# EasyEDA Pro project PCB-1.2-ES.epro, board PCB1
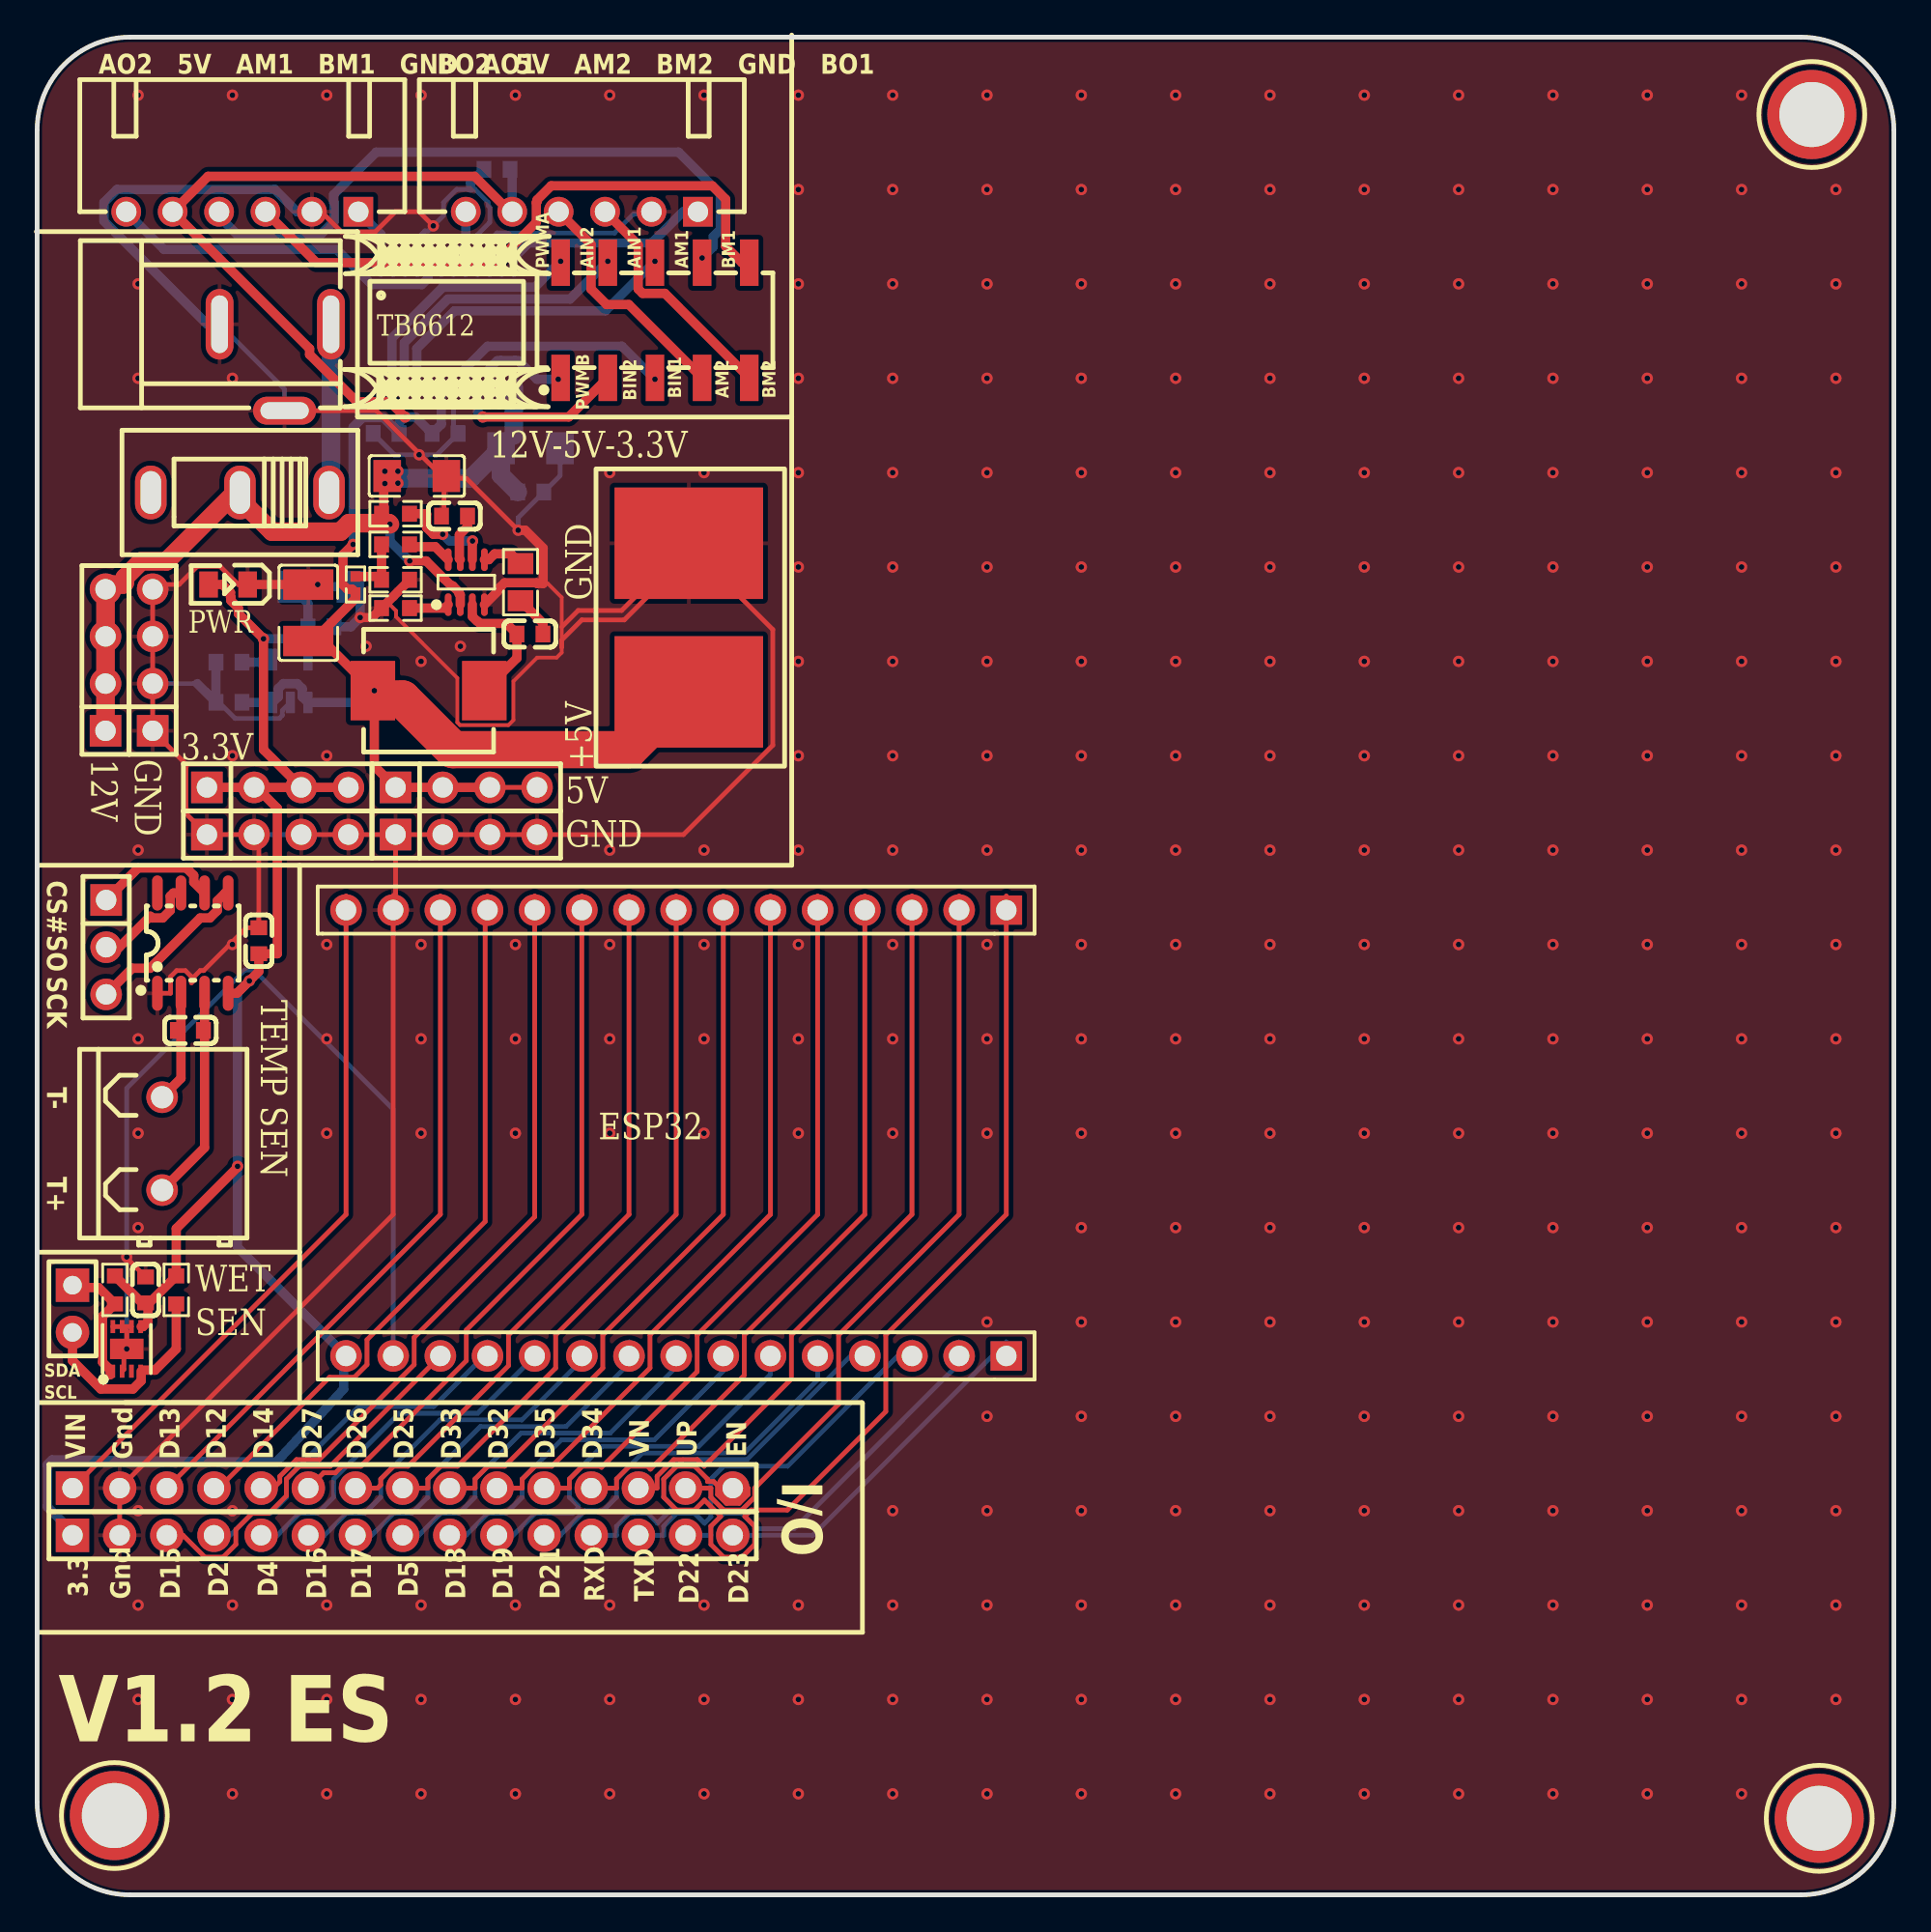
[diagram p1: board, top side]
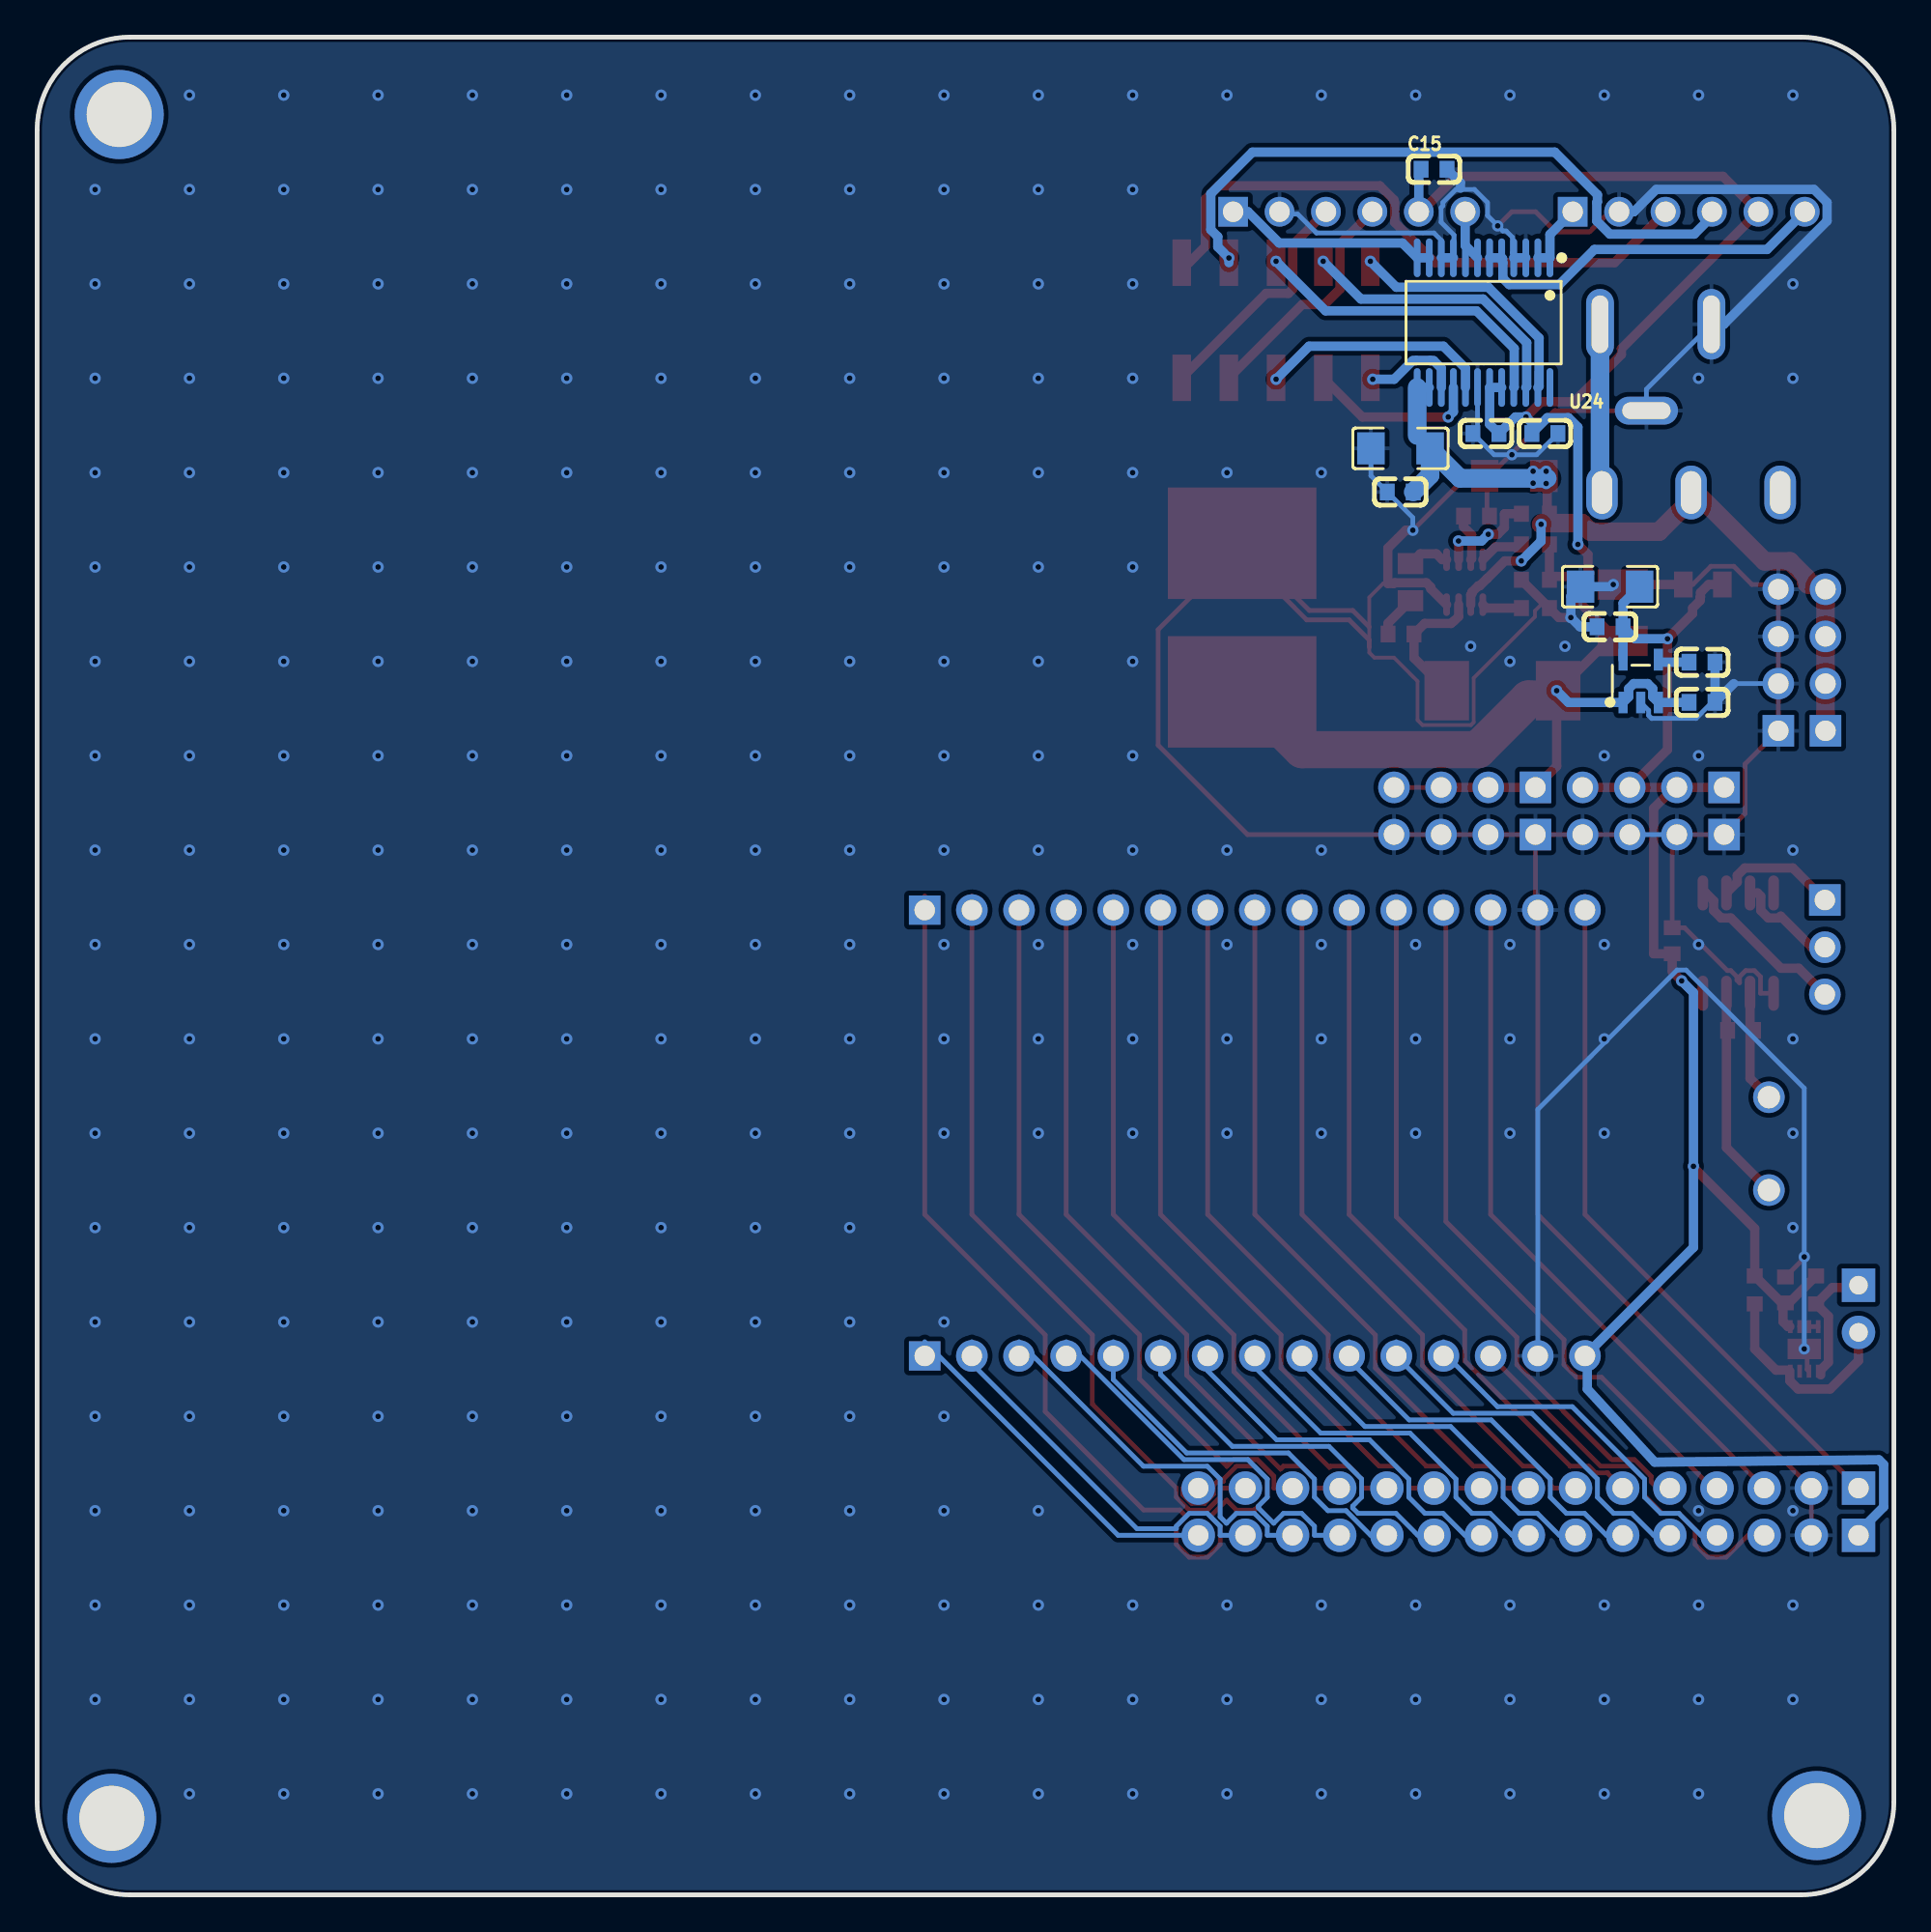
[diagram p2: board, bottom side, seen from below]

Outline 100 x 100 mm; copper layers: Top Layer, Bottom Layer. Coordinates in mm from the lower left corner of the outline.
Outline path: 0,95 0,5 arc(1.46,1.46) 5,0 95,0 arc(98.54,1.46) 100,5 100,95 arc(98.54,98.54) 95,100 5,100 arc(1.46,98.54) 0,95
Stack: Top Layer 0.035mm / Dielectric1 1.51mm FR4 er 4.5 / Bottom Layer 0.035mm

## Design rules (mm)
template: JLCPCB Capability(Two Layers Board)
spacing copperThickness1oz (default): track to track 0.102, other pairs 0.152 to 0.3
spacing copperThickness2oz: track to track 0.203, other pairs 0.152 to 0.3
track width copperThickness1oz (default): min 0.127, default 0.254, max 2.54
track width copperThickness2oz: min 0.203, default 0.254, max 2.54
differential pair differentialPair (default): width min 0.127, default 0.254, max 2.54; gap min 0.152, default 0.152
via viaSize (default): diameter min 0.5, default 0.61, max 10; hole min 0.3, default 0.305, max 6.3

## Placement (name value [footprint] x y rotation side)
C5  22uF  [C1206]  20.45 76.38 180 top
C6  100nF  [C0603]  22.48 74.22 0 top
C7  47uF  [C1210]  14.6 69.01 270 top
C8  100nF  [C0603]  26.54 67.87 0 top
C9  1uF  [C0603]  10.33 64.2 0 bottom
C10  22nF  [C0603]  10.33 66.35 0 bottom
C11  10uF  [C1206]  15.28 70.42 180 bottom
C12  100nF  [C0603]  15.28 68.26 180 bottom
C15  100nF  [C0603]  24.77 92.89 180 bottom
C16  100nF  [C0603]  26.59 75.52 0 bottom
C17  10uF  [C1206]  26.57 77.86 0 bottom
C18  100nF  [C0603]  18.8 78.66 0 bottom
C19  100nF  [C0603]  21.97 78.66 180 bottom
C20  100nF  [C0603]  11.94 51.36 90 top
C21  10nF  [C0603]  8.25 46.53 0 top
C22  100nF  [C0603]  5.84 32.56 270 top
CN1  X8821WR-06S-N0SN  [CONN-TH_6P-P2.50_X8821WR-06S-N2SN]  29.34 90.6 180 top
CN2  X8821WR-06S-N0SN  [CONN-TH_6P-P2.50_X8821WR-06S-N2SN]  11.05 90.6 180 top
DC1  DC-005-A200  [DC-IN-TH_DC-005-A200]  12.83 82.22 0 top
H1-12  PZ254V-11-04P  [HDR-TH_4P-P2.54-V-M]  3.68 66.47 90 top
H2  PZ254V-11-04P  [HDR-TH_4P-P2.54-V-M]  6.22 66.47 90 top
H3-5  PZ254V-11-04P  [HDR-TH_4P-P2.54-V-M]  23.11 59.61 0 top
H4  PZ254V-11-04P  [HDR-TH_4P-P2.54-V-M]  23.11 57.07 0 top
H5-3.3  PZ254V-11-04P  [HDR-TH_4P-P2.54-V-M]  12.95 59.61 0 top
H6  PZ254V-11-04P  [HDR-TH_4P-P2.54-V-M]  12.95 57.07 0 top
H7  HC-PZ254-11.5L-1x15PZ  [HDR-TH_15P-P2.54-V-M-1]  19.69 21.9 0 top
H8  HC-PZ254-11.5L-1x15PZ  [HDR-TH_15P-P2.54-V-M-1]  19.69 19.36 0 top
H11  IPCP254M10PB28S  [HDR-SMD_10P-P2.54-V-M-R2-C5-S2.54-LS7.3]  33.27 84.76 0 top
H12  PZ254V-11-03P  [HDR-TH_3P-P2.54-V-M]  3.72 51.01 270 top
H13  -  [HDR-TH_2P-P2.54-V-M-1]  1.91 31.55 270 top
L2  6.8uH  [IND-SMD_L7.0-W6.6]  21.08 64.82 180 top
LED1  NCD0805R1  [LED0805-R-RD]  10.29 70.54 180 top
R5  100kΩ  [R0603]  19.3 74.35 180 top
R6  75kΩ  [R0603]  19.3 69.27 180 top
R7  20kΩ  [R0603]  19.3 72.7 180 top
R8  40.2kΩ  [R0402]  17.14 70.54 270 top
R9  7.5kΩ  [R0603]  19.3 70.79 180 top
R10  20Ω  [R0805]  26.03 70.66 90 top
R16  10kΩ  [R0603]  7.49 32.56 90 top
R17  10kΩ  [R0603]  4.19 32.56 90 top
U2  MP2315GJ-Z  [TSOT-23-8_L2.9-W1.6-P0.65-LS2.8-BR]  23.11 70.66 270 top
U3  RT9193-33GB  [SOT-23-5_L3.0-W1.7-P0.95-LS2.8-BL]  13.63 65.34 180 bottom
U4  SS12D10G5  [SW-TH_SHOU-HAN_SS12D10G4]  10.92 75.49 180 top
U5  -  [SMD_BD4.2-L4.7-W4.7-D3.0]  95.98 4.12 0 top
U5-M1  KH-2.54FH-1X15P-H8.5  [HDR-TH_15P-P2.54-V-F]  34.42 53.01 180 top
U6-M1  KH-2.54FH-1X15P-H8.5  [HDR-TH_15P-P2.54-V-F]  34.42 29.01 180 top
U7  -  [SMD_BD4.2-L4.7-W4.7-D3.0]  4.16 4.27 0 top
U12  -  [SMD_BD4.2-L4.7-W4.7-D3.0]  95.58 95.84 0 top
U24  TB6612FNG(O,C,8,EL  [SSOP-24_L8.4-W5.8-P0.65-LS7.8-BL]  22.1 84.63 0 bottom
U25  MAX31855KASA+T  [SO-8_L4.9-W3.9-P1.27-LS5.9-BL]  8.38 51.23 0 top
U26  -  [CONN-TH_DB302-5.0-2P]  6.73 40.44 270 top
U27  SHT30-DIS-B10KS  [DFN-8_L2.5-W2.5-P0.50-BL-EP]  4.83 29.39 0 top
U28  -  [PWR]  30.1 60.76 90 top

## Footprints (pads in the part's own frame, mm; a bottom-side part is the same pattern mirrored in y, then rotated)
C0603
  rect 0.8x0.9 smd: 1(-0.7,0) 2(0.7,0)
C1206
  rect 1.485x1.728 smd: 1(-1.593,0) 2(1.593,0)
C1210
  rect 1.635x2.7 smd: 1(-1.518,0) 2(1.518,0)
CONN-TH_6P-P2.50_X8821WR-06S-N2SN
  rect 1.6x1.6 hole 1.1: 1(-6.25,0)
  round 1.6 hole 1.1: 2(-3.75,0) 3(-1.25,0) 4(1.25,0) 5(3.75,0) 6(6.25,0)
CONN-TH_DB302-5.0-2P
  round 1.7 hole 1.2: 1(-2.5,0) 2(2.5,0)
DC-IN-TH_DC-005-A200
  oval 1.5x3.8 hole 0.9x3.1: 1(2.999,2.325) 2(-3,2.325)
  oval 3.4x1.5 hole 2.6x0.9: 3(0.5,-2.325)
DFN-8_L2.5-W2.5-P0.50-BL-EP
  rect 0.25x0.7 smd: 1(-0.75,-1.2) 2(-0.25,-1.2) 3(0.25,-1.2) 4(0.75,-1.2) 5(0.75,1.2) 6(0.25,1.2) 7(-0.25,1.2) 8(-0.75,1.2)
  rect 1.8x1.1 smd: 9(0,0)
HDR-SMD_10P-P2.54-V-M-R2-C5-S2.54-LS7.3
  rect 1x2.5 smd: 1(-5.08,-3.1) 2(-5.08,3.1) 3(-2.54,-3.1) 4(-2.54,3.1) 5(0,-3.1) 6(0,3.1) 7(2.54,-3.1) 8(2.54,3.1) 9(5.08,-3.1) 10(5.08,3.1)
HDR-TH_2P-P2.54-V-M-1
  rect 1.8x1.8 hole 1: 1(-1.27,0)
  round 1.8 hole 1: 2(1.27,0)
HDR-TH_3P-P2.54-V-M
  rect 1.7x1.7 hole 1.1: 1(-2.54,0)
  round 1.7 hole 1.1: 2(0,0) 3(2.54,0)
HDR-TH_4P-P2.54-V-M
  rect 1.7x1.7 hole 1.1: 1(-3.81,0)
  round 1.7 hole 1.1: 2(-1.27,0) 3(1.27,0) 4(3.81,0)
HDR-TH_15P-P2.54-V-F
  rect 1.7x1.575 hole 1.1: 1(-17.78,0)
  round 1.7 hole 1.1: 2(-15.24,0) 3(-12.7,0) 4(-10.16,0) 5(-7.62,0) 6(-5.08,0) 7(-2.54,0) 8(0,0) 9(2.54,0) 10(5.08,0) 11(7.62,0) 12(10.16,0) 13(12.7,0) 14(15.24,0) 15(17.78,0)
HDR-TH_15P-P2.54-V-M-1
  rect 1.8x1.8 hole 1.1: 1(-17.78,0)
  round 1.8 hole 1.1: 2(-15.24,0) 3(-12.7,0) 4(-10.16,0) 5(-7.62,0) 6(-5.08,0) 7(-2.54,0) 8(0,0) 9(2.54,0) 10(5.08,0) 11(7.62,0) 12(10.16,0) 13(12.7,0) 14(15.24,0) 15(17.78,0)
IND-SMD_L7.0-W6.6
  rect 2.4x3.2 smd: 1(-3,0) 2(3,0)
LED0805-R-RD
  rect 1x1.399 smd: 1(1.05,0) 2(-1.05,0)
PWR
  custom 6x8 smd: 1(4,-5) 2(12,-5)
R0402
  rect 0.566x0.54 smd: 1(-0.433,0) 2(0.433,0)
R0603
  rect 0.806x0.864 smd: 1(-0.753,0) 2(0.753,0)
R0805
  rect 1.133x1.377 smd: 1(-1,0) 2(1,0)
SMD_BD4.2-L4.7-W4.7-D3.0
  round 4.8 hole 3.5: 1(0,0)
SO-8_L4.9-W3.9-P1.27-LS5.9-BL
  oval 0.574x1.888 smd: 1(-1.905,-2.699) 2(-0.635,-2.699) 3(0.635,-2.699) 4(1.905,-2.699) 5(1.905,2.699) 6(0.635,2.699) 7(-0.635,2.699) 8(-1.905,2.699)
SOT-23-5_L3.0-W1.7-P0.95-LS2.8-BL
  rect 0.49x1.157 smd: 1(-0.95,-1.153) 2(0,-1.153) 3(0.95,-1.153)
  rect 0.49x1.175 smd: 4(0.95,1.153) 5(-0.95,1.153)
SSOP-24_L8.4-W5.8-P0.65-LS7.8-BL
  oval 0.364x2.082 smd: 1(-3.575,-3.491) 2(-2.925,-3.491) 3(-2.275,-3.491) 4(-1.625,-3.491) 5(-0.975,-3.491) 6(-0.325,-3.491) 7(0.325,-3.491) 8(0.975,-3.491) 9(1.625,-3.491) 10(2.275,-3.491) 11(2.925,-3.491) 12(3.575,-3.491) 13(3.575,3.491) 14(2.925,3.491) 15(2.275,3.491) 16(1.625,3.491) 17(0.975,3.491) 18(0.325,3.491) 19(-0.325,3.491) 20(-0.975,3.491) 21(-1.625,3.491) 22(-2.275,3.491) 23(-2.925,3.491) 24(-3.575,3.491)
SW-TH_SHOU-HAN_SS12D10G4
  oval 1.7x2.9 hole 1.1x2.3: 1(-4.8,0) 2(0,0) 3(4.8,0)
TSOT-23-8_L2.9-W1.6-P0.65-LS2.8-BR
  oval 1.222x0.364 smd: 1(1.211,-0.975) 2(1.211,-0.325) 3(1.211,0.325) 4(1.211,0.975) 5(-1.211,0.975) 6(-1.211,0.325) 7(-1.211,-0.325) 8(-1.211,-0.975)

## Nets
As in the schematic.

Pads without a net: U4 3; U5 1; U7 1; U12 1; U25 8; U27 3

## Via types
v1: diameter 0.61, hole 0.305, Top Layer to Bottom Layer, 307 vias

## Routing (per net, layer and track width the routed paths; a pad name or vN(x,y) marks a point on that pad's centre or on a via; arc(x,y) is an arc through that point)
+3.3V: length 101.5
  Top Layer w0.5: 11.81,59.61 12.94,58.49 12.94,50.66 C20.1 11.94,49.71 v1(11.43,49.2) 10.76,48.53 10.29,48.53 ; 11.81,59.61 H5-3.3.2 H5-3.3.1 ; 11.81,59.61 H5-3.3.3 ; 5.84,31.86 5.97,31.74 5.97,30.85 5.7,30.59 5.6,30.59 ; 5.84,31.86 5.64,31.86 R17.2 ; 5.84,31.86 6.04,31.86 R16.2 7.49,35.87 10.73,39.1 ; LED1.1 9.98,70.54 10.41,70.1 10.41,69.87 10.44,69.84 10.44,69.67 10.84,69.27 10.84,68.97 v1(12.19,67.62) 12.19,61.65 H5-3.3.3 ; H5-3.3.3 H5-3.3.4
  Bottom Layer w0.5: v1(12.19,67.62) 13.94,67.62 C12.2 ; C12.2 14.58,66.49 ; C12.2 14.58,69.53 C11.2 ; H8.1 1.78,19.48 1.78,19.65 0.55,20.88 0.55,23.16 0.81,23.42 12.88,23.29 16.51,27.23 16.51,28.88 16.64,29.01 10.8,34.85 v1(10.8,39.22) 10.8,48.57 v1(11.43,49.2)
+5V: length 107.3
  Top Layer w0.254: H3-5.3 H3-5.4
  Top Layer w0.5: v1(19.81,79.55) 18.99,80.37 17.22,80.37 14.67,82.92 14.67,83.23 CN2.5 9.2,92.51 23.56,92.51 25.46,90.6 CN1.5 ; H3-5.3 H3-5.2 H3-5.1 18.16,60.76 18.16,64.38 ; v1(17.02,72.7) 16.47,72.15 16.47,71.24 16.38,71.15 16.38,70.61 16.71,70.28 16.96,70.28 17.14,70.1 17.14,69.78 14.73,67.37 15.54,67.37 L2.2
  Top Layer w2: 34.97,64.76 31.86,61.65 22.4,61.65 19.67,64.38 18.16,64.38
  Bottom Layer w0.5: C9.2 11.04,64.19 12.68,64.19 12.99,64.49 12.99,64.93 13.26,65.2 14.01,65.2 14.28,64.93 14.28,64.49 14.58,64.19 17.52,64.19 v1(18.16,64.82) ; CN1.5 25.59,92.77 C15.1 ; 21.12,81.14 U24.19 21.77,79.17 C19.2 20.38,79.55 v1(19.81,79.55) 19.5,79.24 C18.2 19.34,78.82 19.34,78.84 18.66,79.52 17.53,79.52 17.02,79 v1(17.02,72.7)
+12V: length 47.9
  Top Layer w0.5: v1(20.07,71.81) 20.95,71.81 21.9,70.86 21.91,70.86 22.3,70.47 22.38,70.47 22.72,70.12 22.72,70.05 22.79,69.98 22.79,69.45 ; 18.67,76.25 18.67,74.34
  Top Layer w1: H1-12.1 H1-12.2 H1-12.3 H1-12.4 3.94,70.54 4.63,70.54 4.72,70.63 4.72,70.9 5.6,71.78 6.96,71.78 10.67,75.49 U4.2 10.92,75.11 12.65,73.38 16.34,73.38 16.8,73.84 18.94,73.84 v1(19,73.78)
  Bottom Layer w0.5: U24.13 U24.14 ; v1(20.07,71.81) 19,72.87 v1(19,73.78)
  Bottom Layer w1: 18.67,76.25 23.37,76.25 C17.1 24.98,76.42 C16.1 ; 25.67,78.56 U24.13
  vias: v1(18.73,76.63) v1(18.73,75.97) v1(19.43,76.63) v1(19.43,75.99)
GND: length 333.1
  Top Layer w0.2: 28.25,67.55 28.25,69.84 27.51,70.59 27.25,70.59 ; 18.73,69.44 19.01,69.44 19.33,69.12 19.33,68.8 22.63,65.5 22.63,63.12 22.78,62.97 25.39,62.97 25.65,63.24 25.65,65.33 26.92,66.6 27.98,66.6 28.25,66.87 28.25,67.16
  Top Layer w0.25: 6.48,48.53 7.18,48.53 7.18,49.42 7.51,49.75 7.98,49.75 8.31,49.42 8.31,49.1 8.45,49.24 8.45,49.42 8.78,49.75 8.97,49.75 11.27,52.06 C20.2
  Top Layer w0.254: U27.2 4.67,28.28 4.67,29.23 v1(4.83,29.39) 4.83,30.34 U27.7 ; U28.2 31.48,69.14 29.14,69.14 28.25,68.25 ; H4.1 H6.4 H6.3 ; H4.1 19.3,53.9 19.18,53.77 19.18,36.63 H7.2 4.44,19.23 ; H4.1 H4.2 H4.3 H4.4 34.81,57.07 39.62,61.89 39.62,68.11 35.1,72.63 35.1,72.11 31.62,68.63 29.34,68.63 28.25,67.55 28.25,67.16 ; 21.91,76.25 18.27,79.89 DC1.3 ; 21.91,76.25 21.91,74.35 C6.1 ; 21.91,76.25 23.11,76.25 v1(25.91,73.46) ; U27.7 U27.8 ; U27.7 U27.6 ; C22.1 4.83,34.28 v1(4.83,34.34) ; C20.2 11.94,56.82 H6.2 H6.1 8.02,58.2 8.02,60.87 H2.1 H2.2 H2.3 H2.4 6.48,70.54 7.64,70.54 8.62,71.52 9.85,71.52 10.83,70.54 LED1.2 ; CN2.2 15.3,90.6 16.38,89.52 18.21,89.52 19.29,90.6 20.57,90.6 v1(21.34,89.84)
  Top Layer w0.5: LED1.2 14.6,70.54 C7.1 ; v1(25.91,73.46) 26.29,73.46 27.25,72.49 27.25,70.59 26.93,70.59 26.89,70.63 25.18,70.63 24.94,70.4 24.94,70.31 24.09,69.45 ; v1(17.4,68.76) 18.04,68.76 R6.2 18.73,69.44 20.06,70.77 20.06,70.92
  Bottom Layer w0.254: 20.33,88.12 20.33,88.18 20.54,88.39 20.54,89.23 20.88,89.57 21.05,89.57 21.88,90.4 21.88,91.1 22.59,91.8 23.27,91.8 23.34,91.87 23.41,91.8 23.58,91.8 24.29,91.1 24.29,90.93 24.38,90.83 24.38,90.04 23.69,89.34 23.69,89.02 23.72,88.99 U24.9 ; DC1.3 13.33,81.05 DC1.2 ; 13.63,64.19 13.21,63.76 13.21,63.49 13.05,63.33 10.66,63.33 9.8,64.19 9.64,64.19 ; v1(4.83,29.39) v1(4.83,34.34) 4.83,43.42 11.19,49.78 11.67,49.78 19.18,42.28 19.18,29.77 ; C18.1 19.24,77.52 v1(20.57,77.52) 21.53,77.52 C19.1 22.42,78.91 U24.18 ; 8.63,65.2 H2.2 ; CN1.2 32.96,90.48 32.11,90.48 31.1,89.46 24.77,89.46 24.37,89.07 U24.10 ; H6.2 H6.3 ; v1(25.91,73.46) 25.91,74.14 C16.2 28.16,76.39 C17.2
  Bottom Layer w0.5: C10.1 C9.1 8.63,65.2 ; U24.3 U24.4 ; CN2.2 14,90.6 12.8,91.8 4.3,91.8 3.6,91.1 3.6,90.1 9.16,84.55 DC1.2 ; C15.2 23.34,92.17 23.34,91.87 ; C12.1 16.9,68.26 v1(17.4,68.76) 17.4,69.9 C11.1 15.23,70.42 v1(15.11,70.54) ; U24.10 U24.9
  vias: v1(5.44,96.88) v1(5.44,86.72) v1(5.44,81.64) v1(5.44,56.24) v1(5.44,46.08) v1(5.44,41) v1(5.44,35.92) v1(5.44,20.68) v1(5.44,15.6) v1(5.44,10.52) v1(10.52,96.88) v1(10.52,81.64) v1(10.52,61.32) v1(10.52,51.16) v1(10.52,20.68) v1(10.52,15.6) v1(10.52,10.52) v1(10.52,5.44) v1(15.6,96.88) v1(15.6,61.32) v1(15.6,51.16) v1(15.6,46.08) v1(15.6,41) v1(15.6,15.6) v1(15.6,10.52) v1(15.6,5.44) v1(17.71,67.21) v1(20.68,96.88) v1(20.68,66.4) v1(20.68,51.16) v1(20.68,46.08) v1(20.68,41) v1(20.68,15.6) v1(20.68,10.52) v1(20.68,5.44) v1(22.8,67.21) v1(25.76,96.88) v1(25.76,51.16) v1(25.76,46.08) v1(25.76,41) v1(25.76,15.6) v1(25.76,10.52) v1(25.76,5.44) v1(30.84,96.88) v1(30.84,76.56) v1(30.84,56.24) v1(30.84,51.16) v1(30.84,46.08) v1(30.84,41) v1(30.84,15.6) v1(30.84,10.52) v1(30.84,5.44) v1(35.92,96.88) v1(35.92,76.56) v1(35.92,56.24) v1(35.92,51.16) v1(35.92,46.08) v1(35.92,41) v1(35.92,15.6) v1(35.92,10.52) v1(35.92,5.44) v1(41,96.88) v1(41,91.8) v1(41,86.72) v1(41,81.64) v1(41,76.56) v1(41,71.48) v1(41,66.4) v1(41,61.32) v1(41,56.24) v1(41,51.16) v1(41,46.08) v1(41,41) v1(41,15.6) v1(41,10.52) v1(41,5.44) v1(46.08,96.88) v1(46.08,91.8) v1(46.08,86.72) v1(46.08,81.64) v1(46.08,76.56) v1(46.08,71.48) v1(46.08,66.4) v1(46.08,61.32) v1(46.08,56.24) v1(46.08,51.16) v1(46.08,46.08) v1(46.08,41) v1(46.08,20.68) v1(46.08,15.6) v1(46.08,10.52) v1(46.08,5.44) v1(51.16,96.88) v1(51.16,91.8) v1(51.16,86.72) v1(51.16,81.64) v1(51.16,76.56) v1(51.16,71.48) v1(51.16,66.4) v1(51.16,61.32) v1(51.16,56.24) v1(51.16,51.16) v1(51.16,46.08) v1(51.16,41) v1(51.16,30.84) v1(51.16,25.76) v1(51.16,20.68) v1(51.16,15.6) v1(51.16,10.52) v1(51.16,5.44) v1(56.24,96.88) v1(56.24,91.8) v1(56.24,86.72) v1(56.24,81.64) v1(56.24,76.56) v1(56.24,71.48) v1(56.24,66.4) v1(56.24,61.32) v1(56.24,56.24) v1(56.24,51.16) v1(56.24,46.08) v1(56.24,41) v1(56.24,35.92) v1(56.24,30.84) v1(56.24,25.76) v1(56.24,20.68) v1(56.24,15.6) v1(56.24,10.52) v1(56.24,5.44) v1(61.32,96.88) v1(61.32,91.8) v1(61.32,86.72) v1(61.32,81.64) v1(61.32,76.56) v1(61.32,71.48) v1(61.32,66.4) v1(61.32,61.32) v1(61.32,56.24) v1(61.32,51.16) v1(61.32,46.08) v1(61.32,41) v1(61.32,35.92) v1(61.32,30.84) v1(61.32,25.76) v1(61.32,20.68) v1(61.32,15.6) v1(61.32,10.52) v1(61.32,5.44) v1(66.4,96.88) v1(66.4,91.8) v1(66.4,86.72) v1(66.4,81.64) v1(66.4,76.56) v1(66.4,71.48) v1(66.4,66.4) v1(66.4,61.32) v1(66.4,56.24) v1(66.4,51.16) v1(66.4,46.08) v1(66.4,41) v1(66.4,35.92) v1(66.4,30.84) v1(66.4,25.76) v1(66.4,20.68) v1(66.4,15.6) v1(66.4,10.52) v1(66.4,5.44) v1(71.48,96.88) v1(71.48,91.8) v1(71.48,86.72) v1(71.48,81.64) v1(71.48,76.56) v1(71.48,71.48) v1(71.48,66.4) v1(71.48,61.32) v1(71.48,56.24) v1(71.48,51.16) v1(71.48,46.08) v1(71.48,41) v1(71.48,35.92) v1(71.48,30.84) v1(71.48,25.76) v1(71.48,20.68) v1(71.48,15.6) v1(71.48,10.52) v1(71.48,5.44) v1(76.56,96.88) v1(76.56,91.8) v1(76.56,86.72) v1(76.56,81.64) v1(76.56,76.56) v1(76.56,71.48) v1(76.56,66.4) v1(76.56,61.32) v1(76.56,56.24) v1(76.56,51.16) v1(76.56,46.08) v1(76.56,41) v1(76.56,35.92) v1(76.56,30.84) v1(76.56,25.76) v1(76.56,20.68) v1(76.56,15.6) v1(76.56,10.52) v1(76.56,5.44) v1(81.64,96.88) v1(81.64,91.8) v1(81.64,86.72) v1(81.64,81.64) v1(81.64,76.56) v1(81.64,71.48) v1(81.64,66.4) v1(81.64,61.32) v1(81.64,56.24) v1(81.64,51.16) v1(81.64,46.08) v1(81.64,41) v1(81.64,35.92) v1(81.64,30.84) v1(81.64,25.76) v1(81.64,20.68) v1(81.64,15.6) v1(81.64,10.52) v1(81.64,5.44) v1(86.72,96.88) v1(86.72,91.8) v1(86.72,86.72) v1(86.72,81.64) v1(86.72,76.56) v1(86.72,71.48) v1(86.72,66.4) v1(86.72,61.32) v1(86.72,56.24) v1(86.72,51.16) v1(86.72,46.08) v1(86.72,41) v1(86.72,35.92) v1(86.72,30.84) v1(86.72,25.76) v1(86.72,20.68) v1(86.72,15.6) v1(86.72,10.52) v1(86.72,5.44) v1(91.8,96.88) v1(91.8,91.8) v1(91.8,86.72) v1(91.8,81.64) v1(91.8,76.56) v1(91.8,71.48) v1(91.8,66.4) v1(91.8,61.32) v1(91.8,56.24) v1(91.8,51.16) v1(91.8,46.08) v1(91.8,41) v1(91.8,35.92) v1(91.8,30.84) v1(91.8,25.76) v1(91.8,20.68) v1(91.8,15.6) v1(91.8,10.52) v1(91.8,5.44) v1(96.88,91.8) v1(96.88,86.72) v1(96.88,81.64) v1(96.88,76.56) v1(96.88,71.48) v1(96.88,66.4) v1(96.88,61.32) v1(96.88,56.24) v1(96.88,51.16) v1(96.88,46.08) v1(96.88,41) v1(96.88,35.92) v1(96.88,30.84) v1(96.88,25.76) v1(96.88,20.68) v1(96.88,15.6) v1(96.88,10.52)
AIN1: length 16.9
  Bottom Layer w0.5: U24.21 20.45,81.17 20.45,83.24 22.48,85.27 30.61,85.27 v1(33.27,87.94)
AIN2: length 15.2
  Bottom Layer w0.5: U24.22 19.77,81.19 19.77,83.55 22.12,85.9 28.7,85.9 v1(30.73,87.94)
AM1: length 35.4
  Bottom Layer w0.5: CN2.4 9.8,90.35 10.75,89.4 15.3,89.4 16,90.1 16,91.1 15.97,91.14 15.97,91.52 18.26,93.81 34.55,93.81 36.79,91.57 36.79,89.64 36.41,89.26 36.41,88.71 v1(35.81,88.11) H11.8
AM2: length 12.8
  Top Layer w0.5: H11.7 31.87,85.61 30.67,85.61 29.83,86.44 29.83,88.86 CN1.4
AO1: length 3.6
  Bottom Layer w0.5: CN2.1 18.52,89.38 U24.1 U24.2
AO2: length 19.8
  Bottom Layer w0.5: CN2.6 6.83,88.57 16.13,88.57 18.02,86.68 20.71,86.68 21.06,87.02 21.06,87.86 21.08,87.87 21.08,88.08 21.12,88.12 U24.6
BIN1: length 12.5
  Bottom Layer w0.5: U24.17 23.07,82.18 24.26,83.36 31.5,83.36 v1(33.27,81.59)
BIN2: length 9.3
  Top Layer w0.5: H11.3 28.63,79.55 v1(24,79.55)
  Bottom Layer w0.5: U24.16 23.72,79.83 v1(24,79.55)
BM1: length 32.8
  Top Layer w0.5: H11.10 37.96,87.86 37.08,88.73 37.08,91.27 36.36,92 27.69,92 26.92,91.24 26.92,91.14 26.88,91.1 26.88,90.03 24.71,87.86 15.04,87.86 CN2.3
BM2: length 12.9
  Top Layer w0.5: H11.9 33.81,86.21 32.61,86.21 32.37,86.44 32.37,88.82 CN1.3
BO1: length 11.6
  Bottom Layer w0.5: CN1.1 34.79,90.6 33.11,88.92 26.47,88.92 U24.12 U24.11
BO2: length 2.8
  Bottom Layer w0.5: CN1.6 23.09,88.79 U24.7
C8: length 7.2
  Top Layer w0.5: 23.72,68.56 23.85,68.44 25.27,68.44 C8.1 25.84,66.58 L2.1 ; U2.3 23.44,68.81 23.69,68.56
FB: length 2.4
  Top Layer w0.5: U2.8 21.44,72.57 20.06,72.57
PWMA: length 13.5
  Bottom Layer w0.5: v1(28.19,87.94) 26.8,86.54 21.84,86.54 19.11,83.8 19.11,81.21 U24.23
PWMB: length 5.3
  Bottom Layer w0.5: U24.15 24.37,82.18 24.78,82.59 24.95,82.59 24.97,82.6 25.72,82.6 25.74,82.59 25.91,82.59 26.91,81.59 v1(28.07,81.59)
$1N1735: length 5.3
  Top Layer w0.5: v1(21.84,73.24) 21.34,73.24 20.98,73.6 20.98,74.32 20.95,74.35 20.18,74.35 ; U2.6 23.44,72.87 v1(23.45,72.88)
  Bottom Layer w0.5: v1(23.45,72.88) 22.21,72.88 v1(21.84,73.24)
$1N1737: length 2.5
  Top Layer w0.5: 22.79,71.87 22.74,71.92 22.74,73.21 23.18,73.65 C6.2
$1N1739: length 2.2
  Top Layer w0.5: R6.1 21.95,69.27 U2.1
$1N1742: length 2.3
  Top Layer w0.5: 24.09,71.87 24.33,71.87 24.64,72.19 25.51,72.19 R10.2
$1N1745: length 3.1
  Top Layer w0.5: 18.55,72.57 18.55,70.92 18.5,70.97 R8.1
$1N1755: length 1.7
  Bottom Layer w0.5: C10.2 12.55,66.35 U3.4
$1N1763: length 9.1
  Bottom Layer w0.254: U4.1 15.83,75.59
  Bottom Layer w1: 15.83,75.59 DC1.1
$1N1765: length 2.3
  Top Layer w0.5: R10.1 27.24,68.46 C8.2
$1N1767: length 59.1
  Top Layer w0.254: H7.15 38.29,21.9 38.29,21.55 37.81,21.07 37.12,21.07 36.64,21.55 36.64,22.04 36.43,22.25 36.1,22.25 36.1,22.38 35.41,23.07 34.44,23.07 33.75,22.38 33.75,21.41 34.44,20.72 35.41,20.72 35.94,21.25 36.82,20.37 36.29,19.84 36.29,18.87 36.98,18.18 37.95,18.18 38.64,18.87 38.64,19.84 38.11,20.37 38.46,20.72 40.41,20.72 45.71,26.02 45.71,30.14 52.2,36.63 52.2,53.77
$1N1768: length 41.7
  Top Layer w0.254: H7.14 36.29,21.9 36.29,21.41 36.98,20.72 37.95,20.72 38.64,21.41 38.64,21.9 43.17,26.42 43.17,30.14 49.66,36.63 49.66,53.77
$1N1769: length 40
  Top Layer w0.254: H7.13 33.39,21.9 33.39,22.53 34.29,23.43 35.56,23.43 35.92,23.07 40.63,27.78 40.63,30.14 47.12,36.63 47.12,53.77
$1N1770: length 39.7
  Top Layer w0.254: 29.84,21.9 31.21,21.9 31.21,22.38 31.9,23.07 32.87,23.07 33.03,22.92 38.09,27.97 38.09,30.14 44.58,36.63 44.58,53.77
$1N1771: length 39.5
  Top Layer w0.254: H7.11 28.67,21.9 28.67,22.38 29.36,23.07 30.33,23.07 30.39,23.01 35.55,28.17 35.55,30.14 42.04,36.63 42.04,53.77
$1N1772: length 39.3
  Top Layer w0.254: H7.10 26.13,21.9 26.13,22.38 26.82,23.07 27.72,23.07 33.01,28.36 33.01,30.14 39.5,36.63 39.5,53.77
$1N1773: length 39.3
  Top Layer w0.254: H7.9 23.59,21.9 23.59,22.38 24.28,23.07 25.18,23.07 30.47,28.36 30.47,30.14 36.96,36.63 36.96,53.77
$1N1774: length 39.3
  Top Layer w0.254: H7.8 21.05,21.9 21.05,22.38 21.74,23.07 22.64,23.07 27.93,28.36 27.93,30.14 34.42,36.63 34.42,53.77
$1N1775: length 39.1
  Top Layer w0.254: H7.7 18.33,21.9 18.51,22.07 18.51,22.38 19.2,23.07 19.97,23.07 25.39,28.49 25.39,30.14 31.88,36.63 31.88,53.77
$1N1776: length 38.9
  Top Layer w0.254: H7.6 15.43,22.72 16.06,22.72 16.42,23.07 17.44,23.07 23.11,28.75 23.11,30.4 29.34,36.63 29.34,53.77
$1N1777: length 39.1
  Top Layer w0.254: 26.8,53.77 26.8,36.5 20.31,30.01 20.31,28.54 15.19,23.43 13.97,23.43 13.07,22.53 13.07,22.24 12.73,21.9 H7.5
$1N1778: length 38.9
  Top Layer w0.254: H7.4 9.78,21.9 15.75,27.86 17.09,27.86 17.77,28.54 17.77,29.88 24.13,36.25 24.13,53.65 24.26,53.77
$1N1779: length 38
  Top Layer w0.254: H7.3 21.72,36.63 21.72,53.77
$1N1781: length 38
  Top Layer w0.254: 16.64,53.77 16.64,36.63 H7.1
$1N1782: length 19
  Bottom Layer w0.254: H8.15 41.78,19.36 52.2,29.77
$1N1783: length 20.8
  Bottom Layer w0.254: 49.66,29.77 49.66,28.6 40.77,19.71 38.64,19.71 38.64,19.84 37.95,20.53 36.98,20.53 36.29,19.84 36.29,19.36 H8.14
$1N1784: length 21
  Bottom Layer w0.254: H8.13 33.75,19.36 33.75,19.84 34.44,20.53 35.41,20.53 35.94,20 36.29,20.35 36.29,22.38 36.98,23.07 40.42,23.07 47.12,29.77
$1N1785: length 21.4
  Bottom Layer w0.254: 29.84,19.36 31.21,19.36 31.21,19.84 31.9,20.53 32.87,20.53 33.4,20 34.23,20.83 34.23,20.92 33.75,21.41 33.75,22.38 34.79,23.43 38.23,23.43 44.58,29.77
$1N1786: length 20.8
  Bottom Layer w0.254: H8.11 28.18,19.36 29.5,20.68 30.48,20.68 31.21,21.41 31.21,22.38 32.61,23.79 38.09,23.79 42.04,27.74 42.04,29.77
$1N1787: length 21.7
  Bottom Layer w0.254: H8.10 25.64,19.36 26.82,20.53 28.85,20.53 29.15,20.83 29.15,20.92 28.67,21.41 28.67,22.38 30.42,24.14 35.63,24.14 39.5,28.01 39.5,29.77
$1N1788: length 20.5
  Bottom Layer w0.254: 36.96,29.77 36.96,28.21 33.25,24.5 28.24,24.5 26.13,22.38 26.13,21.41 25.25,20.53 24.28,20.53 23.1,19.36 H8.9
$1N1789: length 20.4
  Bottom Layer w0.254: 34.42,29.77 34.42,28.4 30.87,24.85 26.06,24.85 23.59,22.38 23.59,21.41 22.71,20.53 21.74,20.53 20.56,19.36 H8.8
$1N1790: length 20.3
  Bottom Layer w0.254: 31.88,29.77 31.88,28.6 28.49,25.21 23.87,25.21 21.05,22.38 21.05,21.41 20.17,20.53 19.2,20.53 18.02,19.36 H8.7
$1N1791: length 20.2
  Bottom Layer w0.254: 29.34,29.77 29.34,28.8 26.11,25.57 21.69,25.57 18.51,22.38 18.51,21.41 17.63,20.53 16.66,20.53 15.48,19.36 H8.6
$1N1792: length 20.1
  Bottom Layer w0.254: 26.8,29.77 26.8,28.99 23.73,25.92 19.5,25.92 15.97,22.38 15.97,21.41 15.09,20.53 14.12,20.53 12.94,19.36 H8.5
$1N1793: length 20
  Bottom Layer w0.254: H8.4 10.4,19.36 11.58,20.53 12.55,20.53 13.43,21.41 13.43,22.38 17.32,26.28 21.35,26.28 24.26,29.19 24.26,29.77
$1N1794: length 20.7
  Top Layer w0.254: 21.72,29.01 15.78,23.07 14.12,23.07 13.43,22.38 13.43,21.48 12.48,20.53 11.58,20.53 10.7,19.66 10.7,18.87 10.01,18.18 9.04,18.18 7.86,19.36 H8.3
$1N8770: length 11.5
  Top Layer w0.5: U26.2 9.02,40.22 9.02,48.53
$1N8790: length 6
  Top Layer w0.5: U26.1 7.75,43.95 7.75,48.53
$1N8843: length 9.1
  Top Layer w0.5: H12.3 5.12,49.88 6.08,49.88 8.78,52.59 9.3,52.59 9.71,52.99 9.71,53.51 10.13,53.93 U25.5
$1N8845: length 6.8
  Top Layer w0.5: H12.1 5.44,55.28 8.03,55.28 8.44,54.87 8.44,54.51 U25.6
$1N8847: length 5.8
  Top Layer w0.5: H12.2 4.42,51.01 6.09,52.68 6.19,52.59 6.76,52.59 7.17,52.99 7.17,53.75 7.34,53.93 U25.7
$1N11564: length 11.1
  Top Layer w0.5: R16.1 7.49,29.39 6.35,28.25 5.71,28.25 ; 5.6,28.19 5.6,27.67 5.16,27.23 3.43,27.23 1.91,28.75 1.91,30.15
$1N11568: length 6.9
  Top Layer w0.5: 3.94,27.99 3.94,28.26 3.52,28.67 3.52,31.14 R17.1 3.31,32.69 1.91,32.69

## Copper pours and planes (outline as drawn; the poured copper is in the pictures)
GND on Top Layer: -0.09,100.09 99.91,100.09 99.91,0.09 -0.09,0.09
GND on Bottom Layer: 0.11,100 100.11,100 100.11,0 0.11,0

## Text on the board
Top Silkscreen Layer: SDA / SCL | PWMA | PWMB | AIN2 | BIN2 | AIN1 | BIN1 | AM1 | AM2 | BM1 | BM2 | AO2   5V   AM1   BM1   GND   AO1 | BO2   5V   AM2   BM2   GND   BO1 | VIN | 3.3 | Gnd | D13 | D15 | D12 | D2 | D14 | D4 | D27 | D16 | D26 | D17 | D25 | D5 | D33 | D18 | D32 | D19 | D35 | D21 | D34 | RXD | VN | TXD | UP | D22 | EN | D23 | CS# | SO | SCK | T- | T+ | I/O | V1.2 ES | TB6612 | PWR | 3.3V | WET / SEN | 5V / GND | ESP32 | GND | +5V | GND / 12V | TEMP SEN | 12V-5V-3.3V
